# Altium schematic sheet plata_esp.SchDoc
size A4
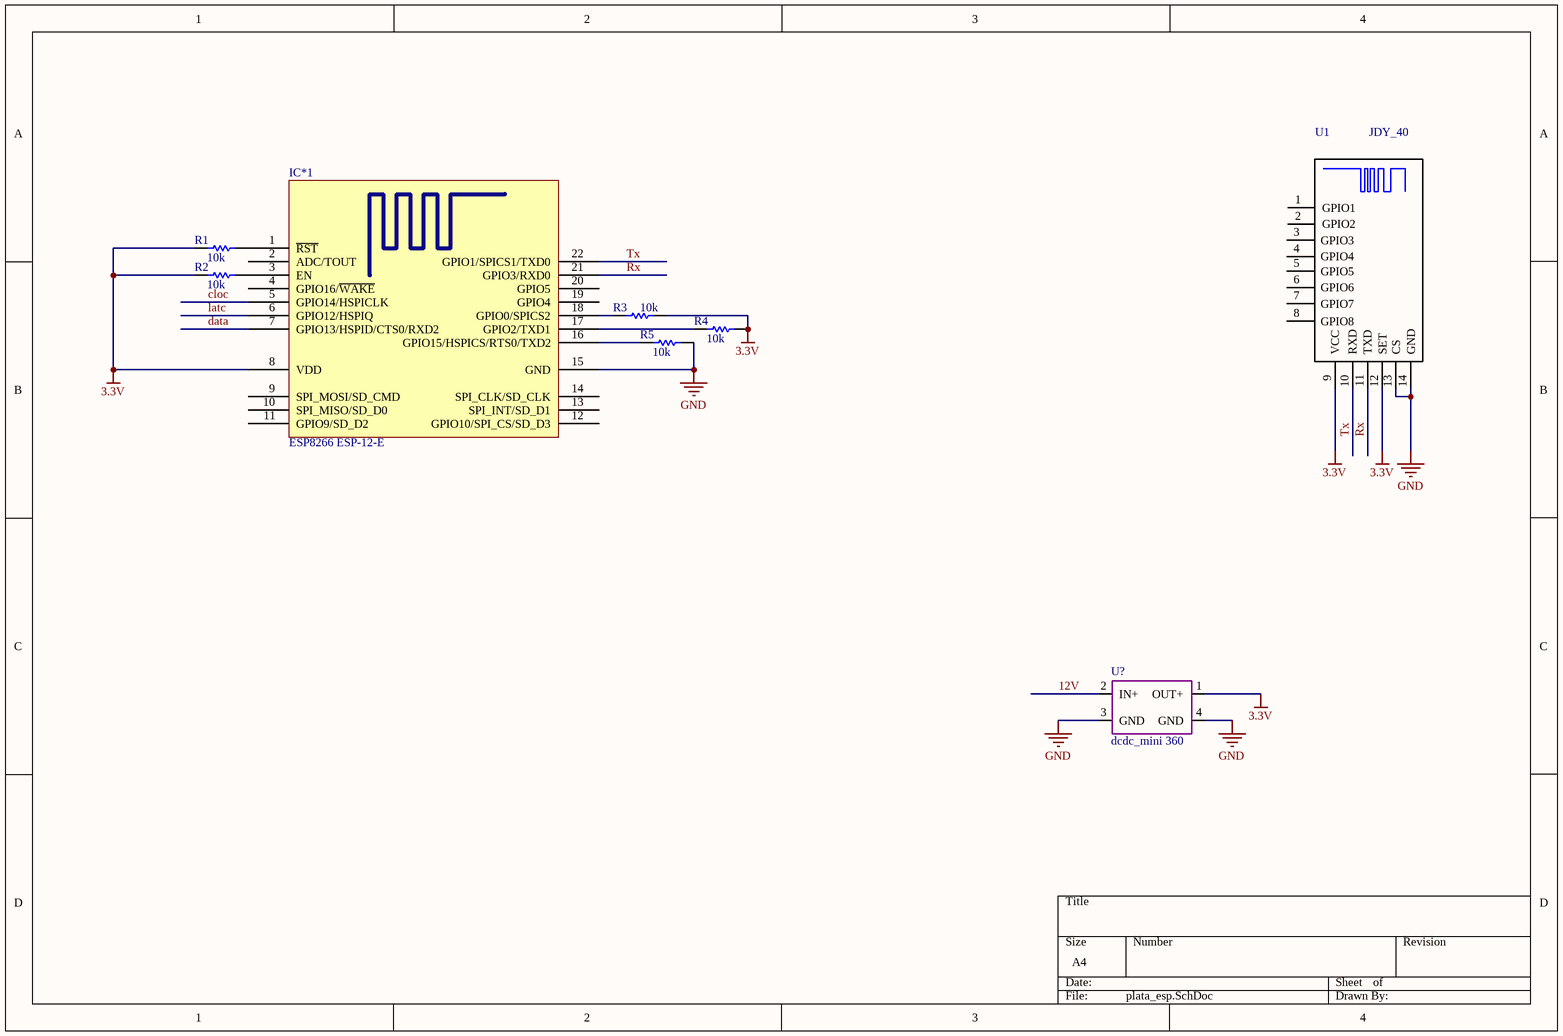
[diagram p0: plata_esp.SchDoc]

## Parts
IC*1  ESP8266 ESP-12-E  [ESP8266 ESP-12-E]
R1  10k  [RESC2013X70X40ML20T20]
R2  10k  [RESC2013X70X40ML20T20]
R3  10k  [RESC2013X70X40ML20T20]
R4  10k  [RESC2013X70X40ML20T20]
R5  10k  [RESC2013X70X40ML20T20]
U1  JDY_40  [JDY_40]
U?  dcdc_mini 360  [dcdc_mini_360]

## Nets
3.3V: IC*1.8(VDD) R1.1 R2.1 R3.2 R4.2 U1.9(VCC) U1.12(SET) U?.1(OUT+)
GND: IC*1.15(GND) R5.2 U1.13(CS) U1.14(GND) U?.3(GND) U?.4(GND)
12V: U?.2(IN+)
cloc: IC*1.5(GPIO14/HSPICLK)
data: IC*1.7(GPIO13/HSPID/CTS0/RXD2)
latc: IC*1.6(GPIO12/HSPIQ)
Rx: IC*1.21(GPIO3/RXD0) U1.11(TXD)
Tx: IC*1.22(GPIO1/SPICS1/TXD0) U1.10(RXD)
NetIC*1_1: IC*1.1(~{RST}) R1.2
NetIC*1_3: IC*1.3(EN) R2.2
NetIC*1_16: IC*1.16(GPIO15/HSPICS/RTS0/TXD2) R5.1
NetIC*1_17: IC*1.17(GPIO2/TXD1) R4.1
NetIC*1_18: IC*1.18(GPIO0/SPICS2) R3.1

Not connected (* = marked no-connect by the designer): IC*1 2(ADC/TOUT) 4(GPIO16/~{WAKE}) 9(SPI_MOSI/SD_CMD) 10(SPI_MISO/SD_D0) 11(GPIO9/SD_D2) 12(GPIO10/SPI_CS/SD_D3) 13(SPI_INT/SD_D1) 14(SPI_CLK/SD_CLK) 19(GPIO4) 20(GPIO5); U1 1(GPIO1) 2(GPIO2) 3(GPIO3) 4(GPIO4) 5(GPIO5) 6(GPIO6) 7(GPIO7) 8(GPIO8)

## Library data of the parts
R1-R5 = CMP-2001-04440-2: RES SMD 150K OHM 1% 1/8W 0805; Manufacturer: Panasonic; Part Number: ERJ-6ENF1503V; Case-EIA: 0805; Datasheet: http://industrial.panasonic.com/cdbs/www-data/pdf/RDA0000/AOA0000C86.pdf
U1 = JDY_40: MF: Advanced Monolithic Systems; Availability: Unavailable; SnapEDA_Link: https://www.snapeda.com/parts/AMS1117-5.0/Advanced%20Monolithic%20Systems/view-part/?ref=snap; Package: None; MP: JDY_40; Price: None; Value: *